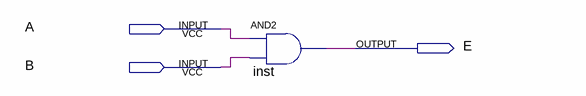
[diagram p0: schematic sheet]
// Quartus schematic And-1-bit.bdf as structural Verilog: 1 symbols, 3 pins
module \And-1-bit  (
  input  A,
  input  B,
  output E
);

  and inst (E, A, B);
endmodule
